# Altium schematic sheet main.SchDoc
size A4; SheetNumber: 1; SheetTotal: 6
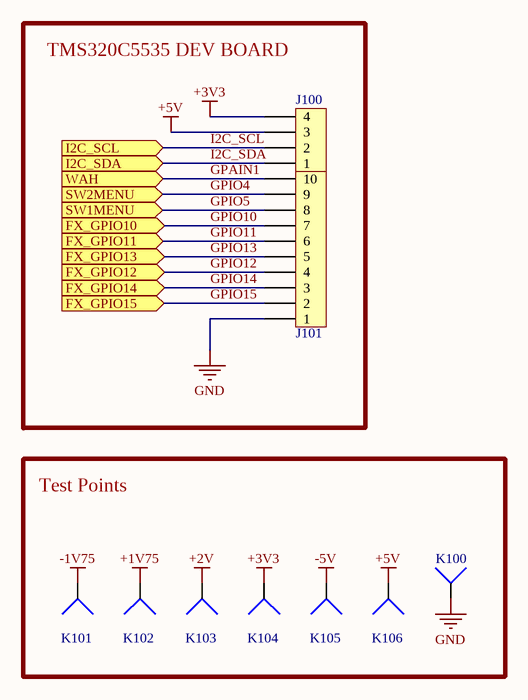
[diagram p0: main.SchDoc]

## Parts
J100  Header 1x4  [Header 1x4]  (value not drawn)
J101  Header 1x10  [Header 1x10]  (value not drawn)
K100  Wire  [Wire 1.5mm]  (value not drawn)
K101  Wire  [Wire 1.5mm]  (value not drawn)
K102  Wire  [Wire 1.5mm]  (value not drawn)
K103  Wire  [Wire 1.5mm]  (value not drawn)
K104  Wire  [Wire 1.5mm]  (value not drawn)
K105  Wire  [Wire 1.5mm]  (value not drawn)
K106  Wire  [Wire 1.5mm]  (value not drawn)

## Blocks framed on the sheet
TMS320C5535 DEV BOARD: J100 J101
Test Points: K100-K106

## Ports
FX_GPIO10 (in), FX_GPIO11 (in), FX_GPIO12 (in), FX_GPIO13 (in), FX_GPIO14 (in), FX_GPIO15 (in), I2C_SCL (in), I2C_SDA (in), SW1MENU (in), SW2MENU (in), WAH (in)

## Nets
+1V75: K102.1
+2V: K103.1
+3V3: J100.4 K104.1
+5V: J100.3 K106.1
-1V75: K101.1
-5V: K105.1
GND: J101.1 K100.1
GPAIN1: J101.10 ; port WAH
GPIO4: J101.9 ; port SW2MENU
GPIO5: J101.8 ; port SW1MENU
GPIO10: J101.7 ; port FX_GPIO10
GPIO11: J101.6 ; port FX_GPIO11
GPIO12: J101.4 ; port FX_GPIO12
GPIO13: J101.5 ; port FX_GPIO13
GPIO14: J101.3 ; port FX_GPIO14
GPIO15: J101.2 ; port FX_GPIO15
I2C_SCL: J100.2 ; port I2C_SCL
I2C_SDA: J100.1 ; port I2C_SDA

## Notes on the sheet
- Title
- Size:
- Date:
- A4
- Project:
- Time:
- Version:
- Sheet
- of
- File:
- Author: